# Altium schematic sheet EngineeringInterface.SchDoc
size A3
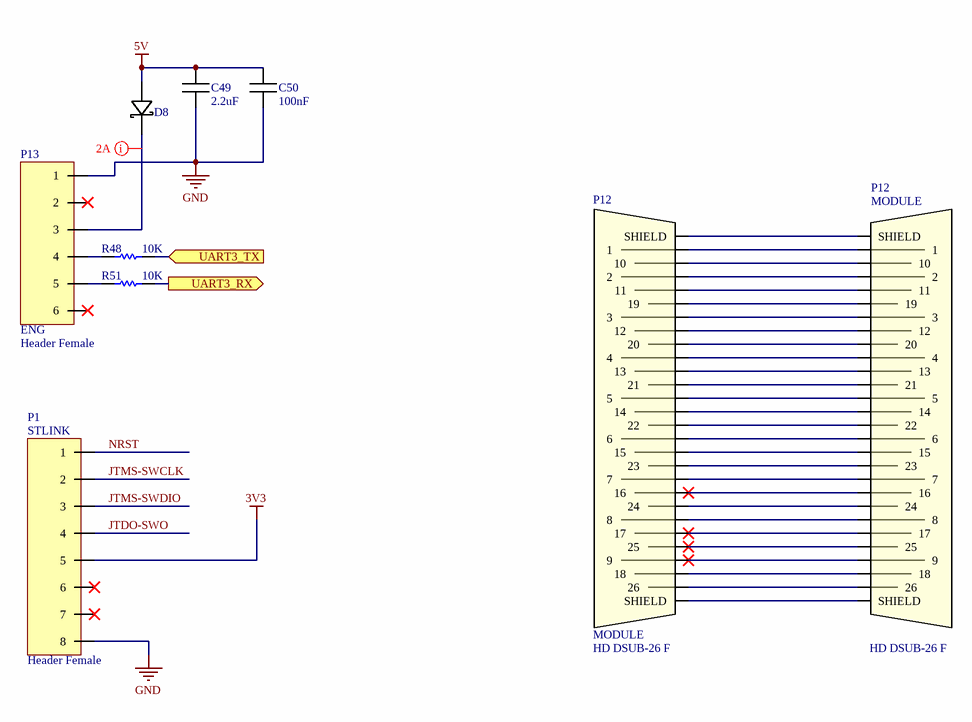
[diagram p0: EngineeringInterface.SchDoc]

## Parts
(Parts that share a designator on the sheet are numbered #1, #2 ... from top to bottom, then left to right.)
C49  value 2.2uF  [CAP 0603 CAPC1608X08N]  (hidden comment: CAP 2.2uF 16V SMT)
C50  value 100nF  [CAP 0805 CGA4]  (hidden comment: CAP 100nF 50V SMT 0805)
D8  DIODE SCHOTTKY 30V  [SOD-323]  (value not drawn)
P1  STLINK  Type: Header Female  [HEADER 0.1" 8 PIN FEMALE]
P12#1  MODULE  Type: HD DSUB-26 F  [DSUB HD 26P F Straight Board Locks]
P12#2  MODULE  Type: HD DSUB-26 F  [DSUB HD 26P F Straight Board Locks]
P13  ENG  Type: Header Female  [HEADER 0.1" 6 PIN FEMALE SMT]
R48  value 10K  [RES 1206]  (hidden comment: RES 10K 1206 SMT)
R51  value 10K  [RES 1206]  (hidden comment: RES 10K 1206 SMT)

## Ports
UART3_RX (out), UART3_TX (in)

## Nets
3V3: P1.5
5V: C49.2 C50.2 D8.A(ANODE)
GND: C49.1 C50.1 P1.8 P13.1
JTDO-SWO: P1.4
JTMS-SWCLK: P1.2
JTMS-SWDIO: P1.3
NRST: P1.1
UART3_RX: R51.2 ; port UART3_RX
UART3_TX: R48.2 ; port UART3_TX
NetD8_C: D8.C(CATHODE) P13.3
NetP12#1_1: P12#1.1 P12#2.1
NetP12#1_2: P12#1.2 P12#2.2
NetP12#1_3: P12#1.3 P12#2.3
NetP12#1_4: P12#1.4 P12#2.4
NetP12#1_5: P12#1.5 P12#2.5
NetP12#1_6: P12#1.6 P12#2.6
NetP12#1_7: P12#1.7 P12#2.7
NetP12#1_8: P12#1.8 P12#2.8
NetP12#1_9: P12#1.9 P12#2.9
NetP12#1_10: P12#1.10 P12#2.10
NetP12#1_11: P12#1.11 P12#2.11
NetP12#1_12: P12#1.12 P12#2.12
NetP12#1_13: P12#1.13 P12#2.13
NetP12#1_14: P12#1.14 P12#2.14
NetP12#1_15: P12#1.15 P12#2.15
NetP12#1_16: P12#1.16 P12#2.16
NetP12#1_17: P12#1.17 P12#2.17
NetP12#1_18: P12#1.18 P12#2.18
NetP12#1_19: P12#1.19 P12#2.19
NetP12#1_20: P12#1.20 P12#2.20
NetP12#1_21: P12#1.21 P12#2.21
NetP12#1_22: P12#1.22 P12#2.22
NetP12#1_23: P12#1.23 P12#2.23
NetP12#1_24: P12#1.24 P12#2.24
NetP12#1_25: P12#1.25 P12#2.25
NetP12#1_26: P12#1.26 P12#2.26
NetP12#1_27: P12#1.27(SHIELD) P12#2.27(SHIELD)
NetP12#1_28: P12#1.28(SHIELD) P12#2.28(SHIELD)
NetP13_4: P13.4 R48.1
NetP13_5: P13.5 R51.1

Not connected (* = marked no-connect by the designer): P1 6* 7*; P13 2* 6*

## Layout directives
net class Trace_2A: NetD8_C

## Notes on the sheet
- Project:
- Document:
- Number:
- Eng:
- PARALLEL FLIGHT TECHNOLOGIES
- Rev:
- Size:
- A4
- Date:
- Sheet:
- of

## Library data of the parts
C49 = CAP 2.2uF 16V SMT: Capacitor 2.2uF 16V 20% 0603 SMT; MFG: TDK; P/N: C1608X7R1A225K080AE; PackageDescription: 0603
C50 = CAP 100nF 50V SMT 0805: Capacitor 100nF 50V 5%; MFG: TDK; P/N: CGA4J2X8R1H104K125AA; PackageDescription: 0805
D8 = DIODE SCHOTTKY 30V: Schottky Diode 30V 800mA; MFG: Toshiba; P/N: CUS08F30,H3F; Vf: 0.22
P1 = CON HEADER FEMALE 8 POS 0.1": Header 8 position female 0.1"; MFG: Samtec; P/N: SAM1213-08-ND
P12#1 P12#2 = CON HD DSUB 26P-F: HD D-Sub Connector 26 pin female vertical; MFG: Amphenol; P/N: 10090929-S264VLF
P13 = CON HEADER FEMALE 6 POS 0.1" SMT: Header 6 position female 0.1"; MFG: Samtec; P/N: SSW-106-22-F-S-VS-K
R48 R51 = RES 10K 1206 SMT: Resistor 10K Ohm 1206 SMT; P/N: ERA-8AEB103V; MFG: Panasonic; Power: 0.25W; Tolerance: 0.1%; PackageDescription: 1206 SMT